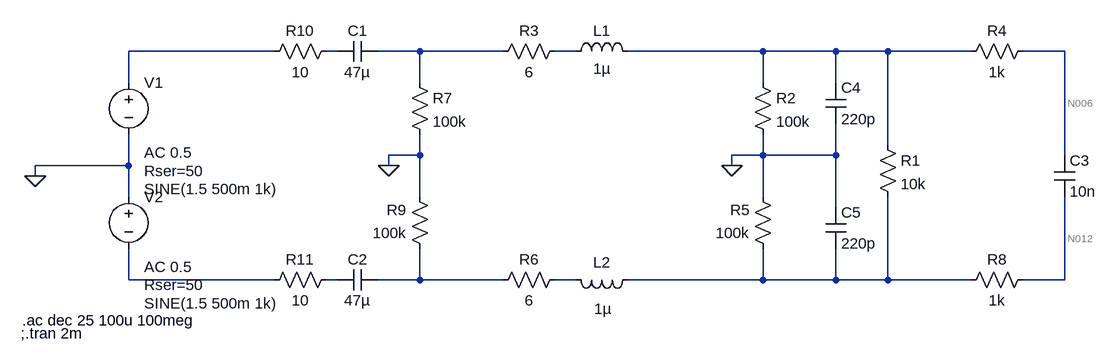
[diagram p0: schematic DiffLine.asc]
DiffLine.asc, the LTspice schematic file:
Version 4
SHEET 1 1672 752
WIRE 320 0 96 0
WIRE 416 0 400 0
WIRE 544 0 480 0
WIRE 672 0 544 0
WIRE 784 0 752 0
WIRE 1072 0 864 0
WIRE 1184 0 1072 0
WIRE 1264 0 1184 0
WIRE 1392 0 1264 0
WIRE 1536 0 1472 0
WIRE 96 48 96 0
WIRE 544 48 544 0
WIRE 1072 48 1072 0
WIRE 1184 48 1184 0
WIRE 1264 144 1264 0
WIRE 544 160 544 128
WIRE 544 160 496 160
WIRE 1072 160 1072 128
WIRE 1072 160 1024 160
WIRE 1184 160 1184 112
WIRE 1184 160 1072 160
WIRE 1536 160 1536 0
WIRE 96 176 96 128
WIRE 96 176 -48 176
WIRE 496 176 496 160
WIRE 1024 176 1024 160
WIRE -48 192 -48 176
WIRE 96 224 96 176
WIRE 544 224 544 160
WIRE 1072 224 1072 160
WIRE 1184 240 1184 160
WIRE 96 352 96 304
WIRE 320 352 96 352
WIRE 416 352 400 352
WIRE 544 352 544 304
WIRE 544 352 480 352
WIRE 672 352 544 352
WIRE 784 352 752 352
WIRE 1072 352 1072 304
WIRE 1072 352 864 352
WIRE 1184 352 1184 304
WIRE 1184 352 1072 352
WIRE 1264 352 1264 224
WIRE 1264 352 1184 352
WIRE 1392 352 1264 352
WIRE 1536 352 1536 224
WIRE 1536 352 1472 352
FLAG -48 192 0
FLAG 1024 176 0
FLAG 496 176 0
SYMBOL voltage 96 32 R0
WINDOW 3 24 180 Left 2
WINDOW 123 24 124 Left 2
WINDOW 39 24 152 Left 2
SYMATTR InstName V1
SYMATTR Value SINE(1.5 500m 1k)
SYMATTR Value2 AC 0.5
SYMATTR SpiceLine Rser=50
SYMBOL voltage 96 208 R0
WINDOW 3 24 180 Left 2
WINDOW 123 24 124 Left 2
WINDOW 39 24 152 Left 2
SYMATTR InstName V2
SYMATTR Value SINE(1.5 500m 1k)
SYMATTR Value2 AC 0.5
SYMATTR SpiceLine Rser=50
SYMBOL cap 480 -16 R90
WINDOW 0 0 32 VBottom 2
WINDOW 3 32 32 VTop 2
SYMATTR InstName C1
SYMATTR Value 47µ
SYMBOL res 1056 32 R0
SYMATTR InstName R2
SYMATTR Value 100k
SYMBOL res 768 -16 R90
WINDOW 0 0 56 VBottom 2
WINDOW 3 32 56 VTop 2
SYMATTR InstName R3
SYMATTR Value 6
SYMBOL ind 768 16 R270
WINDOW 0 32 56 VTop 2
WINDOW 3 5 56 VBottom 2
SYMATTR InstName L1
SYMATTR Value 1µ
SYMBOL cap 416 368 R270
WINDOW 0 32 32 VTop 2
WINDOW 3 0 32 VBottom 2
SYMATTR InstName C2
SYMATTR Value 47µ
SYMBOL res 1088 320 R180
WINDOW 0 36 76 Left 2
WINDOW 3 36 40 Left 2
SYMATTR InstName R5
SYMATTR Value 100k
SYMBOL res 656 368 R270
WINDOW 0 32 56 VTop 2
WINDOW 3 0 56 VBottom 2
SYMATTR InstName R6
SYMATTR Value 6
SYMBOL ind 880 336 R90
WINDOW 0 5 56 VBottom 2
WINDOW 3 45 54 VTop 2
SYMATTR InstName L2
SYMATTR Value 1µ
SYMBOL res 1248 128 R0
SYMATTR InstName R1
SYMATTR Value 10k
SYMBOL cap 1520 160 R0
SYMATTR InstName C3
SYMATTR Value 10n
SYMBOL res 1488 -16 R90
WINDOW 0 0 56 VBottom 2
WINDOW 3 32 56 VTop 2
SYMATTR InstName R4
SYMATTR Value 1k
SYMBOL res 1488 336 R90
WINDOW 0 0 56 VBottom 2
WINDOW 3 32 56 VTop 2
SYMATTR InstName R8
SYMATTR Value 1k
SYMBOL cap 1168 48 R0
SYMATTR InstName C4
SYMATTR Value 220p
SYMBOL cap 1168 240 R0
SYMATTR InstName C5
SYMATTR Value 220p
SYMBOL res 528 32 R0
SYMATTR InstName R7
SYMATTR Value 100k
SYMBOL res 560 320 R180
WINDOW 0 36 76 Left 2
WINDOW 3 36 40 Left 2
SYMATTR InstName R9
SYMATTR Value 100k
SYMBOL res 416 -16 R90
WINDOW 0 0 56 VBottom 2
WINDOW 3 32 56 VTop 2
SYMATTR InstName R10
SYMATTR Value 10
SYMBOL res 416 336 R90
WINDOW 0 0 56 VBottom 2
WINDOW 3 32 56 VTop 2
SYMATTR InstName R11
SYMATTR Value 10
TEXT -68 414 Left 2 !.ac dec 25 100u 100meg
TEXT -70 434 Left 2 !;.tran 2m

The netlist it stands for:
* DiffLine.asc
V1 N001 0 SINE(1.5 500m 1k) AC 0.5 Rser=50
V2 0 N007 SINE(1.5 500m 1k) AC 0.5 Rser=50
C1 N003 N002 47µ
R2 N005 0 100k
R3 N004 N003 6
L1 N004 N005 1µ
C2 N008 N009 47µ
R5 N011 0 100k
R6 N009 N010 6
L2 N011 N010 1µ
R1 N005 N011 10k
C3 N006 N012 10n
R4 N006 N005 1k
R8 N012 N011 1k
C4 N005 0 220p
C5 0 N011 220p
R7 N003 0 100k
R9 N009 0 100k
R10 N002 N001 10
R11 N008 N007 10
.ac dec 25 100u 100meg
;.tran 2m
.backanno
.end

* Results of the author's LTspice run, read from the files saved beside the schematic
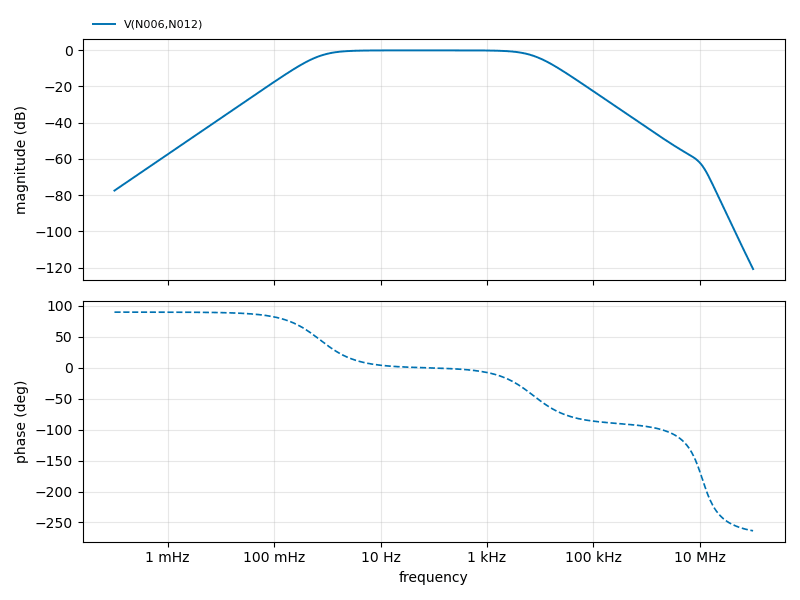
[diagram p1: AC Analysis of DiffLine.asc, plotted from the saved traces]
* AC Analysis, 1 run:
*   V(N006,N012): -77.44 dB at 100 µHz, -120.71 dB at 100 MHz, peak -0.13 dB at 75.86 Hz, 3 dB below the peak at 734.7 mHz and 7.472 kHz